# Altium project MOD-COIL-LN2-21.PrjPCB (part 4 of 4)

## Sheet Power_Supply.SchDoc: Power Supply
size A3; Author: M.Beldyga; CompanyName: WUT ISE; DrawnBy: M.Beldyga; Organization: WUT ISE; Address1: PW ISE; Address2: Nowowiejska 15/19 00-665 Warsaw; Address3: micbeldyga@gmail.com; SheetNumber: 9; SheetTotal: 9; ModifiedBy: -; CheckedDate: -; DivGrp: WUT ISE; Designer: M.Beldyga; ModifiedDate: -; ProjectName: Sensor Box
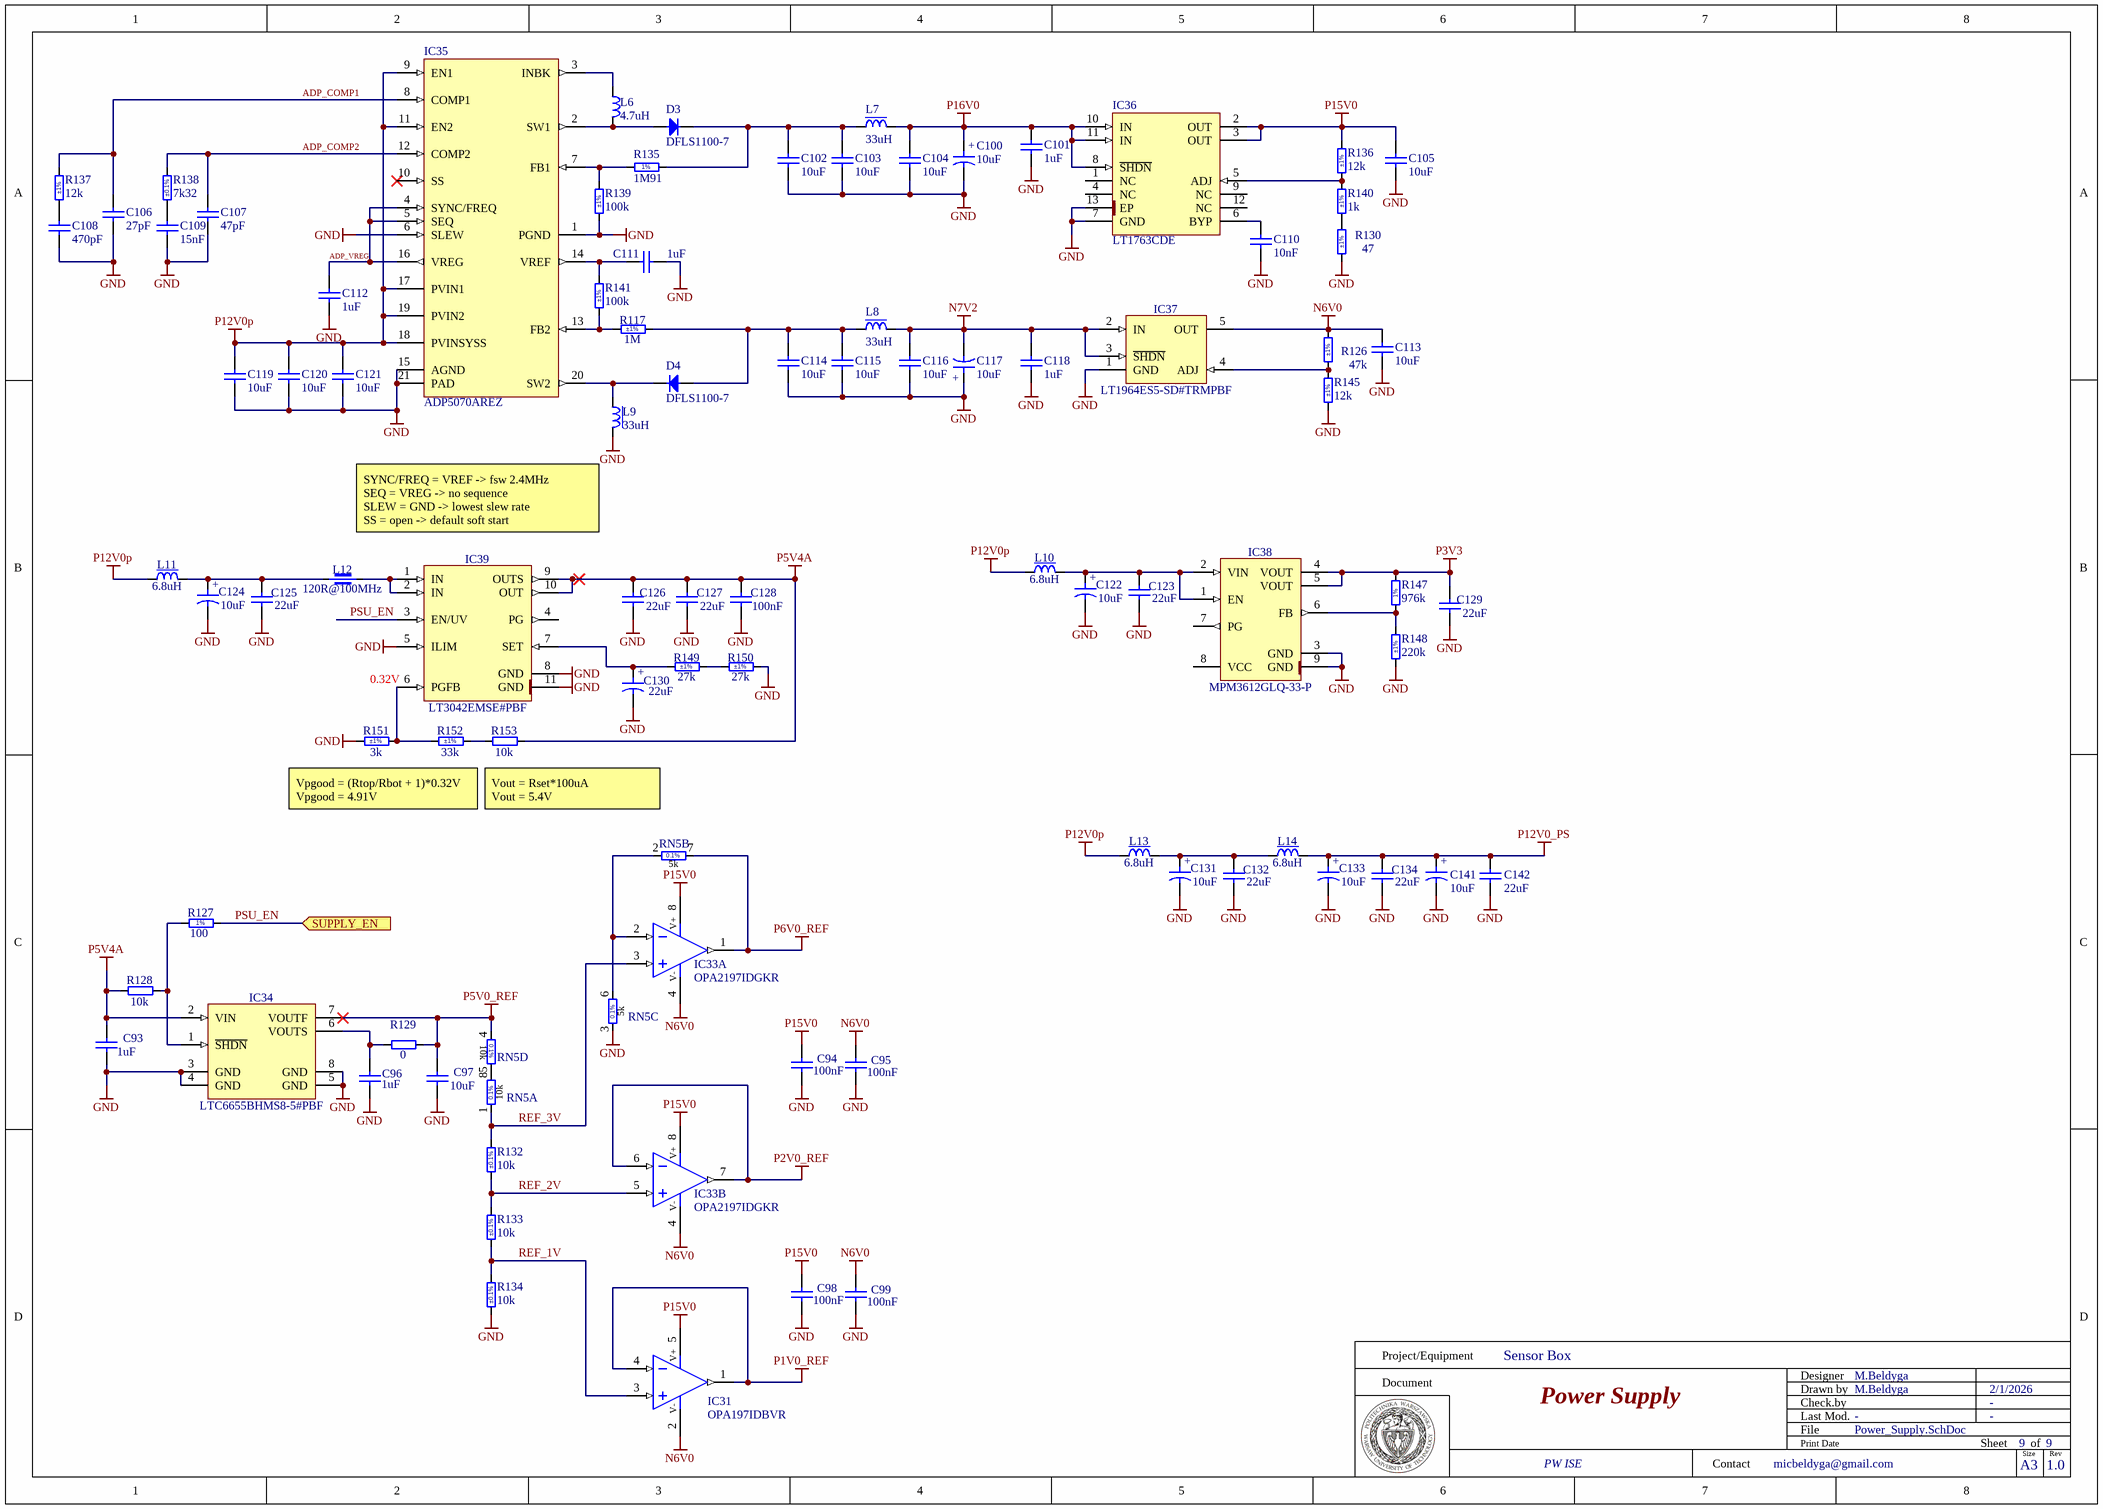
[diagram p8: Power_Supply.SchDoc]

### Parts
C93  1uF  [CAPC1608X87N]
C94  100nF  [CAPC1005X55N]
C95  100nF  [CAPC1005X55N]
C96  1uF  [CAPC1608X87N]
C97  10uF  [CAPC1608X80N]
C98  100nF  [CAPC1005X55N]
C99  100nF  [CAPC1005X55N]
C100  10uF  [CAPMP3216X180N]
C101  1uF  [CAPC1608X87N]
C102  10uF  [CAPC1709X100N]
C103  10uF  [CAPC1709X100N]
C104  10uF  [CAPC1709X100N]
C105  10uF  [CAPC1709X100N]
C106  27pF  [CAPC1005X55N]
C107  47pF  [CAPC1005X55N]
C108  470pF  [CAPC1005X55N]
C109  15nF  [CAPC1005X55N]
C110  10nF  [CAPC1005X55N]
C111  1uF  [CAPC1608X87N]
C112  1uF  [CAPC1608X87N]
C113  10uF  [CAPC1709X100N]
C114  10uF  [CAPC1709X100N]
C115  10uF  [CAPC1709X100N]
C116  10uF  [CAPC1709X100N]
C117  10uF  [CAPMP3216X180N]
C118  1uF  [CAPC1608X87N]
C119  10uF  [CAPC1709X100N]
C120  10uF  [CAPC1709X100N]
C121  10uF  [CAPC1709X100N]
C122  10uF  [CAPMP3216X180N]
C123  22uF  [CAPC2012X135N]
C124  10uF  [CAPMP3216X180N]
C125  22uF  [CAPC2012X135N]
C126  22uF  [CAPC2012X135N]
C127  22uF  [CAPC2012X135N]
C128  100nF  [CAPC1005X55N]
C129  22uF  [CAPC2012X135N]
C130  22uF  [CAPMP3528X210N]
C131  10uF  [CAPMP3216X180N]
C132  22uF  [CAPC2012X135N]
C133  10uF  [CAPMP3216X180N]
C134  22uF  [CAPC2012X135N]
C141  10uF  [CAPMP3216X180N]
C142  22uF  [CAPC2012X135N]
D3  DFLS1100-7  [DIODES-INC_POWERDI123]
D4  DFLS1100-7  [DIODES-INC_POWERDI123]
IC31  OPA197IDBVR  [SOT95P280X145-5N]
IC33  OPA2197IDGKR  [SOP65P490X110-8N]  (parts A,B of 2)
IC34  LTC6655BHMS8-5#PBF  [SOP65P490X110-8N]
IC35  ADP5070AREZ  [SOP65P640X120-21N-R305X425]
IC36  LT1763CDE  [SON50P300X400X80-13N-R180X340]
IC37  LT1964ES5-SD#TRMPBF  [SOT95P280X100-5N]
IC38  MPM3612GLQ-33-P  [MPS_MPM3612]
IC39  LT3042EMSE#PBF  [SOP50P490X110-11N-R168X198]
L6  4.7uH  [IND_COILCRAFT_EPL3015]
L7  33uH  [IND_WURTH_WE-TPC_4828]
L8  33uH  [IND_WURTH_WE-TPC_4828]
L9  33uH  [IND_WURTH_WE-TPC_4828]
L10  6.8uH  [IND_COILCRAFT_XAL4030]
L11  6.8uH  [IND_COILCRAFT_XAL4030]
L12  120R@100MHz  [INDC1608X65N]
L13  6.8uH  [IND_COILCRAFT_XAL4030]
L14  6.8uH  [IND_COILCRAFT_XAL4030]
R117  1M  Tolerance: ±1%  [RESC1005X40N]
R126  47k  Tolerance: ±1%  [RESC1005X40N]
R127  100  [RESC1005X40N]
R128  10k  [RESC1005X35N]
R129  0  [RESC1005X40N]
R130  47  Tolerance: ±1%  [RESC1608X55N]
R132  10k  Tolerance: ±0.1%  [RESC1005X35N]
R133  10k  Tolerance: ±0.1%  [RESC1005X35N]
R134  10k  Tolerance: ±0.1%  [RESC1005X35N]
R135  1M91  [RESC1005X40N]
R136  12k  Tolerance: ±1%  [RESC1005X40N]
R137  12k  Tolerance: ±1%  [RESC1005X40N]
R138  7k32  Tolerance: ±0.1%  [RESC1608X55N]
R139  100k  Tolerance: ±1%  [RESC1005X40N]
R140  1k  Tolerance: ±1%  [RESC1005X40N]
R141  100k  Tolerance: ±1%  [RESC1005X40N]
R145  12k  Tolerance: ±1%  [RESC1005X40N]
R147  976k  [RESC1005X40N]
R148  220k  Tolerance: ±1%  [RESC1005X40N]
R149  27k  Tolerance: ±1%  [RESC1005X40N]
R150  27k  Tolerance: ±1%  [RESC1005X40N]
R151  3k  Tolerance: ±1%  [RESC1005X40N]
R152  33k  Tolerance: ±1%  [RESC1005X40N]
R153  10k  [RESC1005X35N]
RN5  10k 5K 5K 10K  [SOIC127P600X175-8N]  (value not drawn)  (parts A,B,C,D of 4)

### Ports
SUPPLY_EN (in)

### Nets
GND: C93.1 C94.1 C95.1 C96.1 C97.1 C98.1 C99.1 C100.2 C101.1 C102.1 C103.1 C104.1 C105.1 C106.1 C107.1 C108.1 C109.1 C110.1 C111.1 C112.1 C113.1 C114.1 C115.1 C116.1 C117.1 C118.1 C119.1 C120.1 C121.1 C122.2 C123.1 C124.2 C125.1 C126.1 C127.1 C128.1 C129.1 C130.2 C131.2 C132.1 C133.2 C134.1 C141.2 C142.1 IC34.3(GND) IC34.4(GND) IC34.5(GND) IC34.8(GND) IC35.1(PGND) IC35.6(SLEW) IC35.15(AGND) IC35.21(PAD) IC36.7(GND) IC36.13(EP) IC37.1(GND) IC38.3(GND) IC38.9(GND) IC39.5(ILIM) IC39.8(GND) IC39.11(GND) L9.2 R130.1 R134.1 R139.1 R145.1 R148.1 R150.2 R151.1 RN5.3
N6V0: C95.2 C99.2 C113.2 IC31.2(V-) IC33.4(V-) IC37.5(OUT) R126.2
N7V2: C116.2 C117.2 C118.2 IC37.2(IN) IC37.3(~{SHDN}) L8.2
P1V0_REF: IC31.1(OUT) IC31.4(IN-)
P2V0_REF: IC33.6(IN-) IC33.7(OUT)
P3V3: C129.2 IC38.4(VOUT) IC38.5(VOUT) R147.2
P5V0_REF: C97.2 IC34.7(VOUTF) R129.2 RN5.4
P5V4A: C93.2 C126.2 C127.2 C128.2 IC34.2(VIN) IC39.9(OUTS) IC39.10(OUT) R128.1 R153.2
P6V0_REF: IC33.1(OUT) RN5.7
P12V0_PS: C133.1 C134.2 C141.1 C142.2 L14.2
P12V0p: C119.2 C120.2 C121.2 IC35.9(EN1) IC35.11(EN2) IC35.17(PVIN1) IC35.18(PVINSYSS) IC35.19(PVIN2) L10.1 L11.1 L13.1
P15V0: C94.2 C98.2 C105.2 IC31.5(V+) IC33.8(V+) IC36.2(OUT) IC36.3(OUT) R136.2
P16V0: C100.1 C101.2 C104.2 IC36.8(~{SHDN}) IC36.10(IN) IC36.11(IN) L7.2
ADP_COMP1: C106.2 IC35.8(COMP1) R137.2
ADP_COMP2: C107.2 IC35.12(COMP2) R138.2
ADP_VREG: C112.2 IC35.4(SYNC/FREQ) IC35.5(SEQ) IC35.16(VREG)
PSU_EN: IC39.3(EN/UV) R127.2 ; port SUPPLY_EN  [project net Payload_EN]
REF_1V: IC31.3(IN+) R133.1 R134.2
REF_2V: IC33.5(IN+) R132.1 R133.2
REF_3V: IC33.3(IN+) R132.2 RN5.1
NetC96_2: C96.2 IC34.6(VOUTS) R129.1
NetC102_2: C102.2 C103.2 D3.1(C) L7.1 R135.2
NetC108_2: C108.2 R137.1
NetC109_2: C109.2 R138.1
NetC110_2: C110.2 IC36.6(BYP)
NetC111_2: C111.2 IC35.14(VREF) R141.2
NetC114_2: C114.2 C115.2 D4.2(A) L8.1 R117.2
NetC122_1: C122.1 C123.2 IC38.1(EN) IC38.2(VIN) L10.2
NetC124_1: C124.1 C125.2 L11.2 L12.1
NetC130_1: C130.1 IC39.7(SET) R149.1
NetC131_1: C131.1 C132.2 L13.2 L14.1
NetD3_2: D3.2(A) IC35.2(SW1) L6.2
NetD4_1: D4.1(C) IC35.20(SW2) L9.1
NetIC33_2: IC33.2(IN-) RN5.2 RN5.6
NetIC34_1: IC34.1(~{SHDN}) R127.1 R128.2
NetIC35_3: IC35.3(INBK) L6.1
NetIC35_7: IC35.7(FB1) R135.1 R139.2
NetIC35_13: IC35.13(FB2) R117.1 R141.1
NetIC36_5: IC36.5(ADJ) R136.1 R140.2
NetIC37_4: IC37.4(ADJ) R126.1 R145.2
NetIC38_6: IC38.6(FB) R147.1 R148.2
NetIC39_1: IC39.1(IN) IC39.2(IN) L12.2
NetIC39_6: IC39.6(PGFB) R151.2 R152.1
NetR130_2: R130.2 R140.1
NetR149_2: R149.2 R150.1
NetR152_2: R152.2 R153.1
NetRN5_5: RN5.5 RN5.8

Not connected (* = marked no-connect by the designer): IC35 10(SS)*; IC36 1(NC) 4(NC) 9(NC) 12(NC); IC38 7(PG) 8(VCC); IC39 4(PG)

### Notes on the sheet
- SYNC/FREQ = VREF -> fsw 2.4MHz
  SEQ = VREG -> no sequence
  SLEW = GND -> lowest slew rate
  SS = open -> default soft start
- (near IC39) 0.32V
- Vpgood = (Rtop/Rbot + 1)*0.32V
  Vpgood = 4.91V
- Vout = Rset*100uA
  Vout = 5.4V
- Project/Equipment
- Document
- Designer
- Drawn by
- Check.by
- Contact
- File
- Last Mod.
- Print Date
- Sheet
- Size
- A3
- of
- Rev
- (in symbol CTE3216-18_10UF_16V_20%_AVX_TCJ) +
- (in symbol CTE3528-21_22UF_10V_10%_LESR0700) +
- (in symbol R0402_100R_1%_0.0625W_100PPM) 1%
- (in symbol RN_10K_5K_VISHAY_AORN2-1AT3, part A) 10k
- (in symbol RN_10K_5K_VISHAY_AORN2-1AT3, part B) 5k
- (in symbol RN_10K_5K_VISHAY_AORN2-1AT3, part C) 5k
- (in symbol RN_10K_5K_VISHAY_AORN2-1AT3, part D) 10k

### Library data of the parts
C93 C96 = CC0603_1UF_25V_10%_X7R: Non-polarised capacitor; Part Description: SMD Multilayer Chip Ceramic Capacitor; Manufacturer: GENERIC; Manufacturer1 Part Number: GCM188R71E105KA64D; Voltage: 25V; TC: X7R; Tolerance: ±10%; Part Number: CC0603_1UF_25V_10%_X7R; Component Kind: Standard; Component Type: Standard; Pin Count: 2; Value: 1uF; Status: None; Manufacturer Part Number: CC0603_1UF_25V_10%_X7R; Case: 0603; Mounted: Yes; Socket: No; SMD: Yes; Sense: No; Manufacturer1 Example: MURATA; Manufacturer1 ComponentHeight: 0.9mm; HelpURL: \\cern.ch\dfs\Applications\Altium\Datasheets\CC0603_X7R_MURATA.pdf; Author: CERN DEM JLC; CreateDate: 18.01.2011; LatestRevisionDate: 18.01.2011
C94 C95 C98 C99 C128 = CC0402_100NF_16V_10%_X5R: as C51-C53 on sheet Power_Stage; Part Number: CC0402_100NF_16V_10%_X5R; Component Kind: Standard; Component Type: Standard; Pin Count: 2; Value: 100nF; Status: None; Manufacturer Part Number: CC0402_100NF_16V_10%_X5R; Case: 0402; Mounted: Yes; Socket: No; SMD: Yes; Sense: No; Manufacturer1 Example: MURATA; Manufacturer1 ComponentHeight: 0.55mm; HelpURL: \\cern.ch\dfs\Applications\Altium\Datasheets\CC0402_X5R_MURATA_GRM.pdf; Author: CERN DEM JLC; CreateDate: 10.12.2013; LatestRevisionDate: 10.12.2013
C97 = CC0603_10UF_16V_20%_X5R: Non-polarised capacitor; Part Description: SMD Multilayer Chip Ceramic Capacitor; Manufacturer: GENERIC; Manufacturer1 Part Number: GRM188R61C106MA73D; Voltage: 16V; TC: X5R; Tolerance: ±20%; Part Number: CC0603_10UF_16V_20%_X5R; Component Kind: Standard; Component Type: Standard; Pin Count: 2; Value: 10uF; Status: None; Manufacturer Part Number: CC0603_10UF_16V_20%_X5R; Case: 0603; Mounted: Yes; Socket: No; SMD: Yes; Sense: No; Manufacturer1 Example: MURATA; Manufacturer1 ComponentHeight: 0.8mm; HelpURL: \\cern.ch\dfs\Applications\Altium\Datasheets\CC0603_X5R_MURATA_GRM.pdf; Author: CERN DEM MR; CreateDate: 02.03.2016; LatestRevisionDate: 02.03.2016
C100 C117 = CTE3216-18_10UF_16V_20%_AVX_TCJ: Polarised capacitor; Part Description: ESR 0R200 Tantalum Solid Electrolytic Chip Capacitor with Conductive Polymer Electrode; Manufacturer: AVX; Manufacturer Part Number: TCJA106M016R0200; Voltage: 16V; Tolerance: ±20%; Part Number: CTE3216-18_10UF_16V_20%_AVX_TCJ; Component Kind: Standard; Component Type: Standard; Pin Count: 2; Value: 10uF; Status: Preferred; Case: A; Mounted: Yes; Socket: No; SMD: Yes; Sense: No; ComponentHeight: 1.8mm; HelpURL: \\cern.ch\dfs\Applications\Altium\Datasheets\CTE_AVX_TCJ.pdf; Author: CERN DEM JLC; CreateDate: 29.03.2012; LatestRevisionDate: 29.03.2012
C101 C111 C112 C118 = CC0603_1UF_25V_10%_X7R: Non-polarised capacitor; Part Description: SMD Multilayer Chip Ceramic Capacitor; Manufacturer: GENERIC; Manufacturer1 Part Number: GRM188R71E105KA12D; Voltage: 25V; TC: X7R; Tolerance: ±10%; Part Number: CC0603_1UF_25V_10%_X7R; Component Kind: Standard; Component Type: Standard; Pin Count: 2; Value: 1uF; Status: None; Manufacturer Part Number: CC0603_1UF_25V_10%_X7R; Case: 0603; Mounted: Yes; Socket: No; SMD: Yes; Sense: No; Manufacturer1 Example: MURATA; Manufacturer1 ComponentHeight: 0.9mm; HelpURL: \\cern.ch\dfs\Applications\Altium\Datasheets\CC0603_X7R_MURATA.pdf; Author: CERN DEM JLC; CreateDate: 1/18/2011; LatestRevisionDate: 1/18/2011
C102-C105 C113-C116 C119-C121 = CC0603_10UF_25V_20%_X5R: Non-polarised capacitor; Part Description: SMD Multilayer Chip Ceramic Capacitor; Manufacturer: GENERIC; Manufacturer1 Part Number: C1608X5R1E106M080; Voltage: 25V; TC: X5R; Tolerance: ±20%; Part Number: CC0603_10UF_25V_20%_X5R; Component Kind: Standard; Component Type: Standard; Pin Count: 2; Value: 10uF; Status: None; Manufacturer Part Number: CC0603_10UF_25V_20%_X5R; Case: 0603; Mounted: Yes; Socket: No; SMD: Yes; Sense: No; Manufacturer1 Example: TDK; Manufacturer1 ComponentHeight: 1mm; HelpURL: \\cern.ch\dfs\Applications\Altium\Datasheets\CC0603_X5R_TDK_C.pdf; Author: CERN DEM BC; CreateDate: 7/1/2020; LatestRevisionDate: 7/1/2020
C106 = CC0402_27PF_50V_5%_C0G: Non-polarised capacitor; Part Description: SMD Multilayer Chip Ceramic Capacitor; Manufacturer: GENERIC; Manufacturer1 Part Number: C0402C270J5GACTU; Voltage: 50V; TC: C0G/NP0; Tolerance: ±5%; Part Number: CC0402_27PF_50V_5%_C0G; Component Kind: Standard; Component Type: Standard; Pin Count: 2; Value: 27pF; Status: Preferred; Manufacturer Part Number: CC0402_27PF_50V_5%_C0G; Case: 0402; Mounted: Yes; Socket: No; SMD: Yes; Sense: No; Manufacturer1 Example: KEMET; Manufacturer1 ComponentHeight: 0.55mm; HelpURL: \\cern.ch\dfs\Applications\Altium\Datasheets\CC0402_C0G_KEMET_(Commercial Grade).pdf; Author: CERN DEM JLC; CreateDate: 10/25/2012; LatestRevisionDate: 4/22/2015
C107 = CC0402_47PF_50V_5%_C0G: Non-polarised capacitor; Part Description: SMD Multilayer Chip Ceramic Capacitor; Manufacturer: GENERIC; Manufacturer1 Part Number: C0402C470J5GACTU; Voltage: 50V; TC: C0G/NP0; Tolerance: ±5%; Part Number: CC0402_47PF_50V_5%_C0G; Component Kind: Standard; Component Type: Standard; Pin Count: 2; Value: 47pF; Status: Preferred; Manufacturer Part Number: CC0402_47PF_50V_5%_C0G; Case: 0402; Mounted: Yes; Socket: No; SMD: Yes; Sense: No; Manufacturer1 Example: KEMET; Manufacturer1 ComponentHeight: 0.55mm; HelpURL: \\cern.ch\dfs\Applications\Altium\Datasheets\CC0402_C0G_KEMET_(Commercial Grade).pdf; Author: CERN DEM JLC; CreateDate: 12/3/2007; LatestRevisionDate: 4/22/2015
C108 = CC0402_470PF_50V_10%_X7R: Non-polarised capacitor; Part Description: SMD Multilayer Chip Ceramic Capacitor; Manufacturer: GENERIC; Manufacturer1 Part Number: 223858715618; Voltage: 50V; TC: X7R; Tolerance: ±10%; Part Number: CC0402_470PF_50V_10%_X7R; Component Kind: Standard; Component Type: Standard; Pin Count: 2; Value: 470pF; Status: Not Recommended; Manufacturer Part Number: CC0402_470PF_50V_10%_X7R; Case: 0402; Mounted: Yes; Socket: No; SMD: Yes; Sense: No; Manufacturer1 Example: PHYCOMP; Manufacturer1 ComponentHeight: 0.55mm; HelpURL: \\cern.ch\dfs\Applications\Altium\Datasheets\CC0402_NP0_PHYCOMP.pdf; Author: CERN DEM JLC; CreateDate: 12/3/2007; LatestRevisionDate: 12/3/2007
C109 = CC0402_15NF_50V_5%_X7R: Non-polarised capacitor; Part Description: SMD Multilayer Chip Ceramic Capacitor; Manufacturer: GENERIC; Manufacturer1 Part Number: C0402C153J5RACTU; Voltage: 50V; TC: X7R; Tolerance: ±5%; Part Number: CC0402_15NF_50V_5%_X7R; Component Kind: Standard; Component Type: Standard; Pin Count: 2; Value: 15nF; Status: Preferred; Manufacturer Part Number: CC0402_15NF_50V_5%_X7R; Case: 0402; Mounted: Yes; Socket: No; SMD: Yes; Sense: No; Manufacturer1 Example: KEMET; Manufacturer1 ComponentHeight: 0.55mm; HelpURL: \\cern.ch\dfs\Applications\Altium\Datasheets\CC0402_X7R_KEMET.pdf; Author: CERN DEM BC; CreateDate: 9/2/2019; LatestRevisionDate: 9/2/2019
C110 = CC0402_10NF_50V_5%_X7R: Non-polarised capacitor; Part Description: SMD Multilayer Chip Ceramic Capacitor; Manufacturer: GENERIC; Manufacturer1 Part Number: C0402C103J5RAC; Voltage: 50V; TC: X7R; Tolerance: ±5%; Part Number: CC0402_10NF_50V_5%_X7R; Component Kind: Standard; Component Type: Standard; Pin Count: 2; Value: 10nF; Status: Preferred; Manufacturer Part Number: CC0402_10NF_50V_5%_X7R; Case: 0402; Mounted: Yes; Socket: No; SMD: Yes; Sense: No; Manufacturer1 Example: KEMET; Manufacturer1 ComponentHeight: 0.55mm; HelpURL: \\cern.ch\dfs\Applications\Altium\Datasheets\CC0402_X7R_KEMET.pdf; Author: CERN DEM BC; CreateDate: 7/15/2020; LatestRevisionDate: 7/15/2020
C122 C124 C131 C133 C141 = CTE3216-18_10UF_16V_20%_AVX_TCJ: Polarised capacitor; Part Description: ESR 0R200 Tantalum Solid Electrolytic Chip Capacitor with Conductive Polymer Electrode; Manufacturer: AVX; Manufacturer Part Number: TCJA106M016R0200 or  or TR3A106K016C1700; Manufacturer1 Part Number: TCJA106M016R0200; Voltage: 16V; Tolerance: ±20%; Part Number: CTE3216-18_10UF_16V_20%_AVX_TCJ; Component Kind: Standard; Component Type: Standard; Pin Count: 2; Value: 10uF; Status: Preferred; Case: A; Mounted: Yes; Socket: No; SMD: Yes; Sense: No; ComponentHeight: 1.8mm; HelpURL: \\cern.ch\dfs\Applications\Altium\Datasheets\CTE_AVX_TCJ.pdf; Author: CERN DEM JLC; CreateDate: 29.03.2012; LatestRevisionDate: 29.03.2012
C123 C125-C127 C129 C132 C134 C142 = CC0805_22UF_16V_10%_X5R: Non-polarised capacitor; Part Description: SMD Multilayer Chip Ceramic Capacitor; Manufacturer: GENERIC; Manufacturer1 Part Number: C2012X5R1C226KT; Voltage: 16V; TC: X5R; Tolerance: ±10%; Part Number: CC0805_22UF_16V_10%_X5R; Component Kind: Standard; Component Type: Standard; Pin Count: 2; Value: 22uF; Status: Preferred; Manufacturer Part Number: CC0805_22UF_16V_10%_X5R; Case: 0805; Mounted: Yes; Socket: No; SMD: Yes; Sense: No; Manufacturer1 Example: TDK; Manufacturer1 ComponentHeight: 1.35mm; HelpURL: \\cern.ch\dfs\Applications\Altium\Datasheets\CC0805_X5R_TDK_C.pdf; Author: CERN DEM JLC; CreateDate: 25.10.2012; LatestRevisionDate: 25.10.2012
C130 = CTE3528-21_22UF_10V_10%_LESR0700: Polarised capacitor; Part Description: Low ESR 0R7 Solid Tantalum Chip Capacitor; Manufacturer: GENERIC; Manufacturer1 Part Number: TPSB226K010R0700; Voltage: 10V; Tolerance: ±10%; Part Number: CTE3528-21_22UF_10V_10%_LESR0700; Component Kind: Standard; Component Type: Standard; Pin Count: 2; Value: 22uF; Status: Preferred; Manufacturer Part Number: CTE3528-21_22UF_10V_10%_LESR0700; Case: B; Mounted: Yes; Socket: No; SMD: Yes; Sense: No; Manufacturer1 Example: AVX; Manufacturer1 ComponentHeight: 2.1mm; HelpURL: \\cern.ch\dfs\Applications\Altium\Datasheets\CTE-LESR_AVX_TPS.pdf; Author: CERN DEM JLC; CreateDate: 05.05.2008; LatestRevisionDate: 20.01.2009
D3 D4 = DFLS1100-7: Diode; Part Description: High Voltage Schttky Barrier Rectifier; Manufacturer: DIODES INCORPORATED; Voltage: 100V; Power: 1A; PressFit: No; Bonding: No; Part Number: DFLS1100-7; Component Kind: Standard; Component Type: Standard; Device: DFLS1100-7; PackageDescription: SODFL Diode; 2.8mm W X 1.78mm L X mm H Body, POWERDI®123 Case; Manufacturer Part Number: DFLS1100-7; Pin Count: 2; Mounted: Yes; Socket: No; SMD: Yes; Sense: No; ComponentHeight: 1mm; HelpURL: \\cern.ch\dfs\Applications\Altium\Datasheets\DFLS1100-7.pdf; Author: CERN DEM HF; CreateDate: 3/28/2024; LatestRevisionDate: 3/28/2024
IC31 = OPA197IDBVR: Op Amp Single Precision Amplifier R-R I/O ±18V/36V 5-Pin SOT-23 T/R; Manufacturer: Texas Instruments; Manufacturer Lifecycle Status: ACTIVE; Gain Bandwidth Product: 10MHz; Input Bias Current: 5pA; Input Offset Voltage (Vos): 25µV; Number of Channels: 1; Operating Supply Current: 1mA; Output Current per Channel: 65mA; Slew Rate: 20V/µs; Supplier: DigiKey; Supplier Part Number: 296-47813-6-ND; Manufacturer Part Number: OPA197IDBVR; RoHS: Compliant; Category: Amplifiers - Op Amps, Buffer, Instrumentation; Pricing: 1=1.71, 10=1.254, 25=1.1404, 100=1.0149, 250=0.95512, 500=0.9191, 1000=0.88942 (USD); Case/Package: SOT-23; Height: 1.45mm; Lead Free: Lead Free; Length: 2.9mm; Lifecycle Status: Production; Max Operating Temperature: 125°C; Min Operating Temperature: -40°C; Mounting Technology: Surface Mount; Number of Circuits: 1; Pins: 5; Schedule B: 8542330000, 8542330000|8542330000|8542330000|8542330000|8542330000|8542330000|8542330000|8542330000|8542330000|8542330000|8542330000|8542330000|8542330000|8542330000|8542330000|8542330000|8542330000|8542330000|8542330000|8542330000|8542330000|8542330000|8542330000|85; Thickness: 1.2mm; Width: 1.6mm; ComponentLink1URL: https://sigma.octopart.com:443/177332311/technical_drawing/Texas-Instruments-OPA197IDBVR.pdf?src-supplier=Texas+Instruments; ComponentLink1Description: https://sigma.octopart.com:443/177332311/technical_drawing/Texas-Instruments-OPA197IDBVR.pdf?src-supplier=Texas+Instruments; ComponentLink2URL: https://octopart.com:443/opatz8j6/c1?t=Q1P8Bdc4KgCCbFqp7UlYpcJ8AhpVpiPIEDSj71pxBcZVcsUhmuEmpKuLfuswML2SqYTIjZ0KbZTePt0BTa5L0Ib-QO4qx2Pc4AGXPK19iWgmTvAzROBybWvsv8SVdmbKXcfVjzYF5gNG51bfmeDdyG8TPrSMEhnU0XxyolWqRvFZRm1lt3I32W7t_wfMxmeR34edfRjLHyyRFXxPyflRs4eg4WP07F8bmt6pOKmN-USMuy6Faze7x22RpNONDH4EojWIvEjwq6_wS8mD7vZGVP7z7Ngk7vArTcyRg02zIl199DZ1b6QvO1RGY5iVnJ8IHDniUbpBX1tObbv_cSSRQlS6KVLtLLjRXr4EmXhu9GKtw9wXk68tfrl34suuqK6ened5hg&src-supplier=Texas+Instruments; ComponentLink2Description: https://octopart.com:443/opatz8j6/c1?t=Q1P8Bdc4KgCCbFqp7UlYpcJ8AhpVpiPIEDSj71pxBcZVcsUhmuEmpKuLfuswML2SqYTIjZ0KbZTePt0BTa5L0Ib-QO4qx2Pc4AGXPK19iWgmTvAzROBybWvsv8SVdmbKXcfVjzYF5gNG51bfmeDdyG8TPrSMEhnU0XxyolWqRvFZRm1lt3I32W7t_wfMxmeR34edfRjLHyyRFXxPyflRs4eg4WP07F8bmt6pOKmN-USMuy6Faze7x22RpNONDH4EojWIvEjwq6_wS8mD7vZGVP7z7Ngk7vArTcyRg02zIl199DZ1b6QvO1RGY5iVnJ8IHDniUbpBX1tObbv_cSSRQlS6KVLtLLjRXr4EmXhu9GKtw9wXk68tfrl34suuqK6ened5hg&src-supplier=Texas+Instruments; ComponentLink3URL: https://sigma.octopart.com:443/175570406/technical_drawing/Texas-Instruments-OPA197IDBVR.pdf?src-supplier=Texas+Instruments; ComponentLink3Description: https://sigma.octopart.com:443/175570406/technical_drawing/Texas-Instruments-OPA197IDBVR.pdf?src-supplier=Texas+Instruments; ComponentLink4URL: https://sigma.octopart.com:443/169406034/technical_drawing/Texas-Instruments-OPA197IDBVR.pdf?src-supplier=Texas+Instruments; ComponentLink4Description: https://sigma.octopart.com:443/169406034/technical_drawing/Texas-Instruments-OPA197IDBVR.pdf?src-supplier=Texas+Instruments; ComponentLink5URL: https://sigma.octopart.com:443/155939316/technical_drawing/Texas-Instruments-OPA197IDBVR.pdf?src-supplier=Texas+Instruments; ComponentLink5Description: https://sigma.octopart.com:443/155939316/technical_drawing/Texas-Instruments-OPA197IDBVR.pdf?src-supplier=Texas+Instruments; ComponentLink6URL: https://sigma.octopart.com:443/102331370/technical_drawing/Texas-Instruments-OPA197IDBVR.pdf?src-supplier=Texas+Instruments; ComponentLink6Description: https://sigma.octopart.com:443/102331370/technical_drawing/Texas-Instruments-OPA197IDBVR.pdf?src-supplier=Texas+Instruments; ComponentLink7URL: https://datasheet.octopart.com:443/OPA197IDBVR-Texas-Instruments-datasheet-62062805.pdf?src-supplier=Texas+Instruments; ComponentLink7Description: https://datasheet.octopart.com:443/OPA197IDBVR-Texas-Instruments-datasheet-62062805.pdf?src-supplier=Texas+Instruments; ComponentLink8URL: https://sigma.octopart.com:443/49249325/technical_drawing/Texas-Instruments-OPA197IDBVR.pdf?src-supplier=Texas+Instruments; ComponentLink8Description: https://sigma.octopart.com:443/49249325/technical_drawing/Texas-Instruments-OPA197IDBVR.pdf?src-supplier=Texas+Instruments; ComponentLink9URL: https://datasheet.octopart.com:443/OPA197IDBVR-Texas-Instruments-datasheet-164361763.pdf?src-supplier=SHENGYU+ELECTRONICS; ComponentLink9Description: https://datasheet.octopart.com:443/OPA197IDBVR-Texas-Instruments-datasheet-164361763.pdf?src-supplier=SHENGYU+ELECTRONICS; ComponentLink10URL: https://datasheet.octopart.com:443/OPA197IDBVR-Texas-Instruments-datasheet-165804228.pdf?src-supplier=LCSC; ComponentLink10Description: https://datasheet.octopart.com:443/OPA197IDBVR-Texas-Instruments-datasheet-165804228.pdf?src-supplier=LCSC; ComponentLink11URL: https://datasheet.octopart.com:443/OPA197IDBVR-Texas-Instruments-datasheet-159115560.pdf?src-supplier=LCSC; ComponentLink11Description: https://datasheet.octopart.com:443/OPA197IDBVR-Texas-Instruments-datasheet-159115560.pdf?src-supplier=LCSC; ComponentLink12URL: https://datasheet.octopart.com:443/OPA197IDBVR-Texas-Instruments-datasheet-140571582.pdf?src-supplier=Arrow.cn; ComponentLink12Description: https://datasheet.octopart.com:443/OPA197IDBVR-Texas-Instruments-datasheet-140571582.pdf?src-supplier=Arrow.cn; ComponentLink13URL: https://datasheet.octopart.com:443/OPA197IDBVR-Texas-Instruments-datasheet-137316104.pdf?src-supplier=Future+Electronics; ComponentLink13Description: https://datasheet.octopart.com:443/OPA197IDBVR-Texas-Instruments-datasheet-137316104.pdf?src-supplier=Future+Electronics; ComponentLink14URL: http://sigma.octopart.com:80/reach_statement/Texas-Instruments-company-64.pdf?src-supplier=Compliance+Statements; ComponentLink14Description: http://sigma.octopart.com:80/reach_statement/Texas-Instruments-company-64.pdf?src-supplier=Compliance+Statements; ComponentLink15URL: http://sigma.octopart.com:80/conflict_mineral_statement/Texas-Instruments-company-63.pdf?src-supplier=Compliance+Statements; ComponentLink15Description: http://sigma.octopart.com:80/conflict_mineral_statement/Texas-Instruments-company-63.pdf?src-supplier=Compliance+Statements
IC33 = OA_OPA2197IDGKR: 36-V, Precision, Rail-to-Rail Input Output, Low Offset Voltage Op Amp 8-VSSOP; Part Description: High-Precision, Low-Noise, Rail-to-Rail Output,10-MHz Op Amp; Manufacturer1: TEXAS INSTRUMENTS; PressFit: No; Bonding: No; Part Number: OPA2197IDGKR; Component Kind: Standard; Component Type: Standard; Device: OPA2197IDGKR; PackageDescription: SOP, 0.65mm pitch; 8 pin, 3.00mm W X 3.00mm L X 1.10mm H body, IPC Medium Density; Manufacturer1 Part Number: OPA2197IDGKR; Pin Count: 8; Case: MSOP8; Mounted: Yes; Socket: No; SMD: Yes; Sense: No; ComponentHeight: 1.1mm; Author: GK; HelpURL: \\cern.ch\dfs\Applications\Altium\Datasheets\OPA2140AIDGK.pdf; CreateDate: 20.04.2017; LatestRevisionDate: 20.04.2017
IC34 = LTC6655BHMS8-5#PBF: 0.25ppm Noise, Low Drift Precision Buffered Voltage Reference; Part Description: 5V, 0.25ppm Noise, Low Drift Precision Buffered Voltage Reference; Manufacturer1: LINEAR TECHNOLOGY; PressFit: No; Bonding: No; Part Number: LTC6655BHMS8-5#PBF; Component Kind: Standard; Component Type: Standard; Device: LTC6655BHMS8-5#PBF; PackageDescription: SOP, 8-Leads, Body 3.1x3.1mm (max), Pitch 0.65mm, IPC Medium Density; Manufacturer1 Part Number: LTC6655BHMS8-5#PBF; Pin Count: 8; Case: SSOP8; Mounted: Yes; Socket: No; SMD: Yes; Sense: No; ComponentHeight: 1.1mm; HelpURL: \\cern.ch\dfs\Applications\Altium\Datasheets\LTC6655BHMS8-5#PBF.pdf; Author: CERN DEM JLC; CreateDate: 07.06.2012; LatestRevisionDate: 07.06.2012
IC35 = ADP5070AREZ: 1A/0.6A, DC-to-DC Switching Regulator with Independent Positive and Negative Outputs; Manufacturer: ANALOG DEVICES; PressFit: No; Bonding: No; Part Number: ADP5070AREZ; Component Kind: Standard; Component Type: Standard; Device: ADP5070AREZ; PackageDescription: SOP, 0.65mm Pitch; 20 Pin, 4.40mm W X 6.50mm L X 1.20mm H Body (w/Thermal Tab 3.05mm X 4.25mm), IPC Medium Density; Part Description: 1A/0.6A, DC-to-DC Switching Regulator with Independent Positive and Negative Outputs; Manufacturer Part Number: ADP5070ARE; Pin Count: 20; Case: SSOP20; Mounted: Yes; Socket: No; SMD: Yes; Sense: No; ComponentHeight: 1.2mm; HelpURL: \\cern.ch\dfs\Applications\Altium\Datasheets\ADP5070AREZ.pdf; Author: CERN DEM JLC; CreateDate: 6/21/2017; LatestRevisionDate: 4/1/2022
IC36 = LT1763CDE: 1.22V to 20V 500mA, Low Noise, LDO Adjustable Micropower Regulator; Part Description: 1.22V to 20V, 500mA, Low Noise, LDO Adjustable Micropower Regulator; Manufacturer: LINEAR TECHNOLOGY; PressFit: No; Bonding: No; Part Number: LT1763CDE; Component Kind: Standard; Component Type: Standard; Device: LT1763CDE; PackageDescription: SON, (DFN) 0.50mm Pitch; 12 Pin, 3.00mm W X 4.00mm L X 0.80mm H body (w/Thermal Tab 1.80 X 3.40mm), IPC Medium Density; Manufacturer Part Number: LT1763CDE; Pin Count: 13; Case: SON12; Mounted: Yes; Socket: No; SMD: Yes; Sense: No; ComponentHeight: 0.8mm; HelpURL: \\cern.ch\dfs\Applications\Altium\Datasheets\LT1763.pdf; Author: CERN DEM HF; CreateDate: 4/25/2023; LatestRevisionDate: 4/25/2023
IC37 = LT1964ES5-SD#TRMPBF: 200mA, Low Noise, Low Dropout Negative Micropower Regulator; Part Description: -1.22V to -20V, 200mA, Low Noise, Low Dropout Negative Micropower Regulator; Manufacturer: LINEAR TECHNOLOGY; PressFit: No; Bonding: No; Part Number: LT1964ES5-SD#TRMPBF; Component Kind: Standard; Component Type: Standard; Device: LT1964ES5-SD#TRMPBF; PackageDescription: SOT23, 0.95mm pitch; 5 pin, 1.75mm W X 3.00mm L, IPC Medium Density; Manufacturer Part Number: LT1964ES5-SD#TRMPBF; Pin Count: 5; Case: SOT23-5; Mounted: Yes; Socket: No; SMD: Yes; Sense: No; ComponentHeight: 1mm; HelpURL: \\cern.ch\dfs\Applications\Altium\Datasheets\LT1964ES5-SD#TRMPBF.pdf; Author: CERN DEM JLC; CreateDate: 05.05.2009; LatestRevisionDate: 05.05.2009
IC38 = MPM3612GLQ-33-P: 3V to 22V Input, 1A, Ultra-Low 5µA IQ Power Module; Manufacturer: MPS (MONOLITIC  POWER SYSTEMS); PressFit: No; Bonding: No; Part Number: MPM3612GLQ-33-P; Component Kind: Standard; Component Type: Standard; Device: MPM3612GLQ-33-P; PackageDescription: MPS LGA-9 Case, 0.65mm Pitch, Rect.; 8 Pin, 3.00mm L X 3.00mm W X 2.10mm H body (w/Thermal Tab 1.10 X 1.90mm); Part Description: 3V to 22V Input, 1A, Ultra-Low 5µA IQ Power Module; Manufacturer Part Number: MPM3612GLQ-33-P; Pin Count: 9; Case: LGA8; Mounted: Yes; Socket: No; SMD: Yes; Sense: No; ComponentHeight: 2.1mm; HelpURL: \\cern.ch\dfs\Applications\Altium\Datasheets\MPM3612.pdf; Author: CERN DEM HF; CreateDate: 07.01.2026; LatestRevisionDate: 07.01.2026
IC39 = LT3042EMSE#PBF: 20V, 200mA, Ultralow Noise, Ultrahigh PSRR RF Linear Regulator; Manufacturer1: LINEAR TECHNOLOGY; PressFit: No; Bonding: No; Part Number: LT3042EMSE#PBF; Component Kind: Standard; Component Type: Standard; Device: LT3042EMSE#PBF; PackageDescription: SOP, 0.50mm, Pitch; 10 pin, 3.00mm W X 3.00mm L X 1.10mm H body (w/thermal tab  1.68 X 1.98 mm), IPC Medium Density; Part Description: 20V, 200mA, Ultralow Noise, Ultrahigh PSRR RF Linear Regulator; Manufacturer1 Part Number: LT3042EMSE#PBF; Pin Count: 11; Case: MSOP10; Mounted: Yes; Socket: No; SMD: Yes; Sense: No; ComponentHeight: 1.1mm; HelpURL: \\cern.ch\dfs\Applications\Altium\Datasheets\LT3042EMSE#PBF.pdf; Author: CERN DEM MR; CreateDate: 09.06.2016; LatestRevisionDate: 09.06.2016
L6 = IND_4.7UH_20%_COILCRAFT_EPL3015: Inductor; Part Description: Shielded SMD Power Inductor; Manufacturer Part Number: EPL3015-472ML; Power: 1A; Resistance: 0.145R; Tolerance: ±20%; Part Number: IND_4.7UH_20%_COILCRAFT_EPL3015; Component Kind: Standard; Component Type: Standard; Pin Count: 2; Value: 4.7uH; Manufacturer: COILCRAFT; Mounted: Yes; Socket: No; SMD: Yes; Sense: No; ComponentHeight: 1.55mm; HelpURL: \\cern.ch\dfs\Applications\Altium\Datasheets\IND_COILCRAFT_EPL3015.pdf; Author: CERN DEM BC; CreateDate: 2/27/2017; LatestRevisionDate: 2/27/2017
L7-L9 = IND_33UH_30%_WURTH_WE-TPC_744043330: Inductor With Core; Part Description: Shielded Tiny Power Inductor (WE-TPC Series); Manufacturer: WURTH ELEKTRONIK; Power: 820mA; Resistance: 0.23R; Tolerance: ±30%; Part Number: IND_33UH_30%_WURTH_WE-TPC_744043330; Component Kind: Standard; Component Type: Standard; Pin Count: 2; Value: 33uH; Manufacturer Part Number: 744043330; Mounted: Yes; Socket: No; SMD: Yes; Sense: No; ComponentHeight: 3mm; HelpURL: \\cern.ch\dfs\Applications\Altium\Datasheets\IND_WURTH_WE-TPC_744043330.pdf; Author: CERN DEM JLC; CreateDate: 11/24/2014; LatestRevisionDate: 11/24/2014
L10 L11 L13 L14 = IND_6.8UH_20%_COILCRAFT_XAL4030: Inductor With Core; Part Description: SMD Shielded Power Inductor; Manufacturer1 Part Number: XAL4030-682MEC; Power: 3A; Resistance: 0.0741R; Tolerance: ±20%; Part Number: IND_6.8UH_20%_COILCRAFT_XAL4030; Component Kind: Standard; Component Type: Standard; Pin Count: 2; Value: 6.8uH; Status: None; Manufacturer1: COILCRAFT; Mounted: Yes; Socket: No; SMD: Yes; Sense: No; ComponentHeight: 2.1mm; HelpURL: \\cern.ch\dfs\Applications\Altium\Datasheets\IND_COILCRAFT_XAL4030.pdf; Author: CERN DEM MR; CreateDate: 14.03.2016; LatestRevisionDate: 14.03.2016
L12 = IND0603_MURATA_BLM18SG121TN1D: Part Description: SMD EMIFIL Suppression Chip Ferrite Bead; Manufacturer1: MURATA; Power: 3A; Resistance: 0.025R; Tolerance: ±25%; Part Number: IND0603_MURATA_BLM18SG121TN1D; Component Kind: Standard; Component Type: Standard; Pin Count: 2; Value: 120R@100MHz; Manufacturer1 Part Number: BLM18SG121TN1D; Case: 0603; Mounted: Yes; Socket: No; SMD: Yes; Sense: No; ComponentHeight: 0.65mm; HelpURL: \\cern.ch\dfs\Applications\Altium\Datasheets\IND0603_MURATA_BLM18S.pdf; Author: CERN DEM JLC; CreateDate: 23.07.2014; LatestRevisionDate: 25.10.2018
R117 = R0402_1M_1%_0.0625W_100PPM: Resistor - 1%; Part Description: General Purpose Thick Film Chip Resistor; Manufacturer: GENERIC; Manufacturer1 Part Number: 232270671005L; TC: ±100ppm/°C; PressFit: No; Part Number: R0402_1M_1%_0.0625W_100PPM; Component Kind: Standard; Component Type: Standard; Pin Count: 2; Value: 1M; Status: Not Recommended; Power: 0.0625W; Manufacturer Part Number: R0402_1M_1%_0.0625W_100PPM; Case: 0402; Mounted: Yes; Sense: No; Socket: No; SMD: Yes; Manufacturer1 ComponentHeight: 0.4mm; HelpURL: \\cern.ch\dfs\Applications\Altium\Datasheets\R0402_Phycomp_RC0402.pdf; Author: CERN DEM JLC; CreateDate: 12/3/2007; LatestRevisionDate: 10/17/2012; Manufacturer1 Example: YAGEO PHYCOMP
R126 = R0402_47K_1%_0.0625W_100PPM: Resistor - 1%; Part Description: General Purpose Thick Film Chip Resistor; Manufacturer: GENERIC; Manufacturer1 Part Number: 232270674703L; TC: ±100ppm/°C; PressFit: No; Part Number: R0402_47K_1%_0.0625W_100PPM; Component Kind: Standard; Component Type: Standard; Pin Count: 2; Value: 47k; Status: Not Recommended; Power: 0.0625W; Manufacturer Part Number: R0402_47K_1%_0.0625W_100PPM; Case: 0402; Mounted: Yes; Sense: No; Socket: No; SMD: Yes; Manufacturer1 Example: YAGEO PHYCOMP; Manufacturer1 ComponentHeight: 0.4mm; HelpURL: \\cern.ch\dfs\Applications\Altium\Datasheets\R0402_Phycomp_RC0402.pdf; Author: CERN DEM JLC; CreateDate: 03.12.2007; LatestRevisionDate: 17.10.2012
R127 = R0402_100R_1%_0.0625W_100PPM: Resistor - 1%; Part Description: General Purpose Thick Film Chip Resistor; Manufacturer: GENERIC; Manufacturer1: Vishay; Manufacturer1 Part Number: RCA0402100RFKED; TC: ±100ppm/°C; PressFit: No; Part Number: R0402_100R_1%_0.0625W_100PPM; Component Kind: Standard; Component Type: Standard; Pin Count: 2; Value: 100; Status: Not Recommended; Power: 0.0625W; Tolerance: ±1%; Manufacturer Part Number: R0402_100R_1%_0.0625W_100PPM; Case: 0402; Mounted: Yes; Sense: No; Socket: No; SMD: Yes; Manufacturer1 ComponentHeight: 0.4mm; HelpURL: \\cern.ch\dfs\Applications\Altium\Datasheets\R0402_Phycomp_RC0402.pdf; Author: CERN DEM JLC; CreateDate: 03.12.2007; LatestRevisionDate: 17.10.2012
R128 R132-R134 R153 = R0402_10K_0.1%_0.063W_25PPM: Resistor - 0.1%; Part Description: Thin Film Precision Resistor; Manufacturer: GENERIC; Manufacturer1 Part Number: CPF0402B10KE1; Power: 0.063W; TC: ±25ppm/°C; PressFit: No; Part Number: R0402_10K_0.1%_0.063W_25PPM; Component Kind: Standard; Component Type: Standard; Pin Count: 2; Value: 10k; Status: Not Recommended; Manufacturer Part Number: R0402_10K_0.1%_0.063W_25PPM; Case: 0402; Mounted: Yes; Sense: No; Socket: No; SMD: Yes; Manufacturer1 ComponentHeight: 0.35mm; HelpURL: \\cern.ch\dfs\Applications\Altium\Datasheets\R0402_TYCO_CPF.pdf; Author: CERN DEM JMW; CreateDate: 9/22/2015; LatestRevisionDate: 9/22/2015; Manufacturer1 Example: TE CONNECTIVITY
  R128 R153: Tolerance: ±0.1%
R129 = R0402_0R_JUMPER: Resistor; Part Description: 1A (0.05R Max DC Resistance) Zero Ohm Jumper; Manufacturer: GENERIC; Manufacturer1: Vishay; Manufacturer1 Part Number: CRCW04020000Z0EDC; Part Number: R0402_0R_JUMPER; Component Kind: Standard; Component Type: Standard; Pin Count: 2; Value: 0; Status: Not recommended; Manufacturer Part Number: R0402_0R_JUMPER; Case: 0402; Mounted: Yes; Sense: No; Socket: No; SMD: Yes; Manufacturer1 ComponentHeight: 0.4mm; HelpURL: \\cern.ch\dfs\Applications\Altium\Datasheets\R0402_Phycomp_RC0402.pdf; Author: CERN DEM JLC; CreateDate: 03.12.2007; LatestRevisionDate: 17.10.2012
R130 = R0603_47R_1%_0.1W_100PPM: Resistor - 1%; Part Description: General Purpose Thick Film Chip Resistor; Manufacturer: GENERIC; Manufacturer1 Part Number: NRC06F47R0TRF; Power: 0.1W; TC: ±100ppm/°C; PressFit: No; Part Number: R0603_47R_1%_0.1W_100PPM; Component Kind: Standard; Component Type: Standard; Pin Count: 2; Value: 47; Status: Preferred; Manufacturer Part Number: R0603_47R_1%_0.1W_100PPM; Case: 0603; Mounted: Yes; Sense: No; Socket: No; SMD: Yes; Manufacturer1 Example: NIC COMPONENT; Manufacturer1 ComponentHeight: 0.55mm; HelpURL: \\cern.ch\dfs\Applications\Altium\Datasheets\R0603_NIC_NRC.pdf; Author: CERN DEM JLC; CreateDate: 03.12.2007; LatestRevisionDate: 13.03.2008
R135 = R0402_1M91_1%_0.0625W: RES 1M91 OHM 1% 1/16W 0402; Manufacturer: GENERIC; Manufacturer 1: Yageo; Manufacturer 1 Part Number: RC0402FR-071M91L; Manufacturer 2 Part Number: RMCF0402FT1M91; Manufacturer 3 Part Number: CRCW04021M91FKED; Part Number: R0402_1M91_1%_0.0625W; Component Kind: Standard; Component Type: Standard; Pin Count: 2; Value: 1M91; Power: 0.0625W; Tolerance: 1%; Manufacturer Part Number: R0402_1M91_1%_0.0625W; Case: 0402; Status: Active; Manufacturer 2: Stackpole Electronics; Manufacturer 3: Vishay Dale; Author: Michal Beldyga; CreateDate: 9/16/2024; LastRevision: 9/16/2024
R136 R137 R145 = R0402_12K_1%_0.0625W_100PPM: Resistor - 1%; Part Description: General Purpose Thick Film Chip Resistor; Manufacturer: GENERIC; Manufacturer1 Part Number: 232270671203L; TC: ±100ppm/°C; PressFit: No; Part Number: R0402_12K_1%_0.0625W_100PPM; Component Kind: Standard; Component Type: Standard; Pin Count: 2; Value: 12k; Status: Not Recommended; Power: 0.0625W; Manufacturer Part Number: R0402_12K_1%_0.0625W_100PPM; Case: 0402; Mounted: Yes; Sense: No; Socket: No; SMD: Yes; Manufacturer1 Example: YAGEO PHYCOMP; Manufacturer1 ComponentHeight: 0.4mm; HelpURL: \\cern.ch\dfs\Applications\Altium\Datasheets\R0402_Phycomp_RC0402.pdf; Author: CERN DEM JLC; CreateDate: 12/3/2007; LatestRevisionDate: 10/17/2012
R138 = R0603_7K32_0.1%_0.063W_10PPM: Resistor - 0.1%; Part Description: Thin Film Chip Resistor; Manufacturer: GENERIC; Manufacturer1 Part Number: RN73C1J7K32BTDF; Power: 0.063W; TC: ±10ppm; PressFit: No; Part Number: R0603_7K32_0.1%_0.063W_10PPM; Component Kind: Standard; Component Type: Standard; Pin Count: 2; Value: 7k32; Status: Not Recommended; Manufacturer Part Number: R0603_7K32_0.1%_0.063W_10PPM; Case: 0603; Mounted: Yes; Sense: No; Socket: No; SMD: Yes; Manufacturer1 Example: TYCO HOLSWORTHY; Manufacturer1 ComponentHeight: 0.5mm; HelpURL: \\cern.ch\dfs\Applications\Altium\Datasheets\R0603_Tyco_RN73.pdf; Author: CERN DEM JLC; CreateDate: 12/3/2007; LatestRevisionDate: 3/13/2008
R139 R141 = R0402_100K_1%_0.0625W_100PPM: Resistor - 1%; Part Description: General Purpose Thick Film Chip Resistor; Manufacturer: GENERIC; Manufacturer1 Part Number: 232270671004L; TC: ±100ppm/°C; PressFit: No; Part Number: R0402_100K_1%_0.0625W_100PPM; Component Kind: Standard; Component Type: Standard; Pin Count: 2; Value: 100k; Status: Not Recommended; Power: 0.0625W; Manufacturer Part Number: R0402_100K_1%_0.0625W_100PPM; Case: 0402; Mounted: Yes; Sense: No; Socket: No; SMD: Yes; Manufacturer1 Example: YAGEO PHYCOMP; Manufacturer1 ComponentHeight: 0.4mm; HelpURL: \\cern.ch\dfs\Applications\Altium\Datasheets\R0402_Phycomp_RC0402.pdf; Author: CERN DEM JLC; CreateDate: 12/3/2007; LatestRevisionDate: 10/17/2012
R140 = R0402_1K_1%_0.0625W_100PPM: Resistor - 1%; Part Description: General Purpose Thick Film Chip Resistor; Manufacturer: GENERIC; Manufacturer1 Part Number: 232270671002L; TC: ±100ppm/°C; PressFit: No; Part Number: R0402_1K_1%_0.0625W_100PPM; Component Kind: Standard; Component Type: Standard; Pin Count: 2; Value: 1k; Status: Not Recommended; Power: 0.0625W; Manufacturer Part Number: R0402_1K_1%_0.0625W_100PPM; Case: 0402; Mounted: Yes; Sense: No; Socket: No; SMD: Yes; Manufacturer1 Example: YAGEO PHYCOMP; Manufacturer1 ComponentHeight: 0.4mm; HelpURL: \\cern.ch\dfs\Applications\Altium\Datasheets\R0402_Phycomp_RC0402.pdf; Author: CERN DEM JLC; CreateDate: 12/3/2007; LatestRevisionDate: 10/17/2012
R147 = R0402_976K_1%_0.0625W: RES 976k OHM 1% 1/16W 0402; Manufacturer: GENERIC; Manufacturer 1: Yageo; Manufacturer 1 Part Number: RC0402FR-07976KL; Manufacturer 2 Part Number: RMCF0402FT976K; Manufacturer 3 Part Number: CRCW0402976KFKED; Part Number: R0402_976K_1%_0.0625W; Component Kind: Standard; Component Type: Standard; Pin Count: 2; Value: 976k; Power: 0.0625W; Tolerance: 1%; Manufacturer Part Number: R0402_976K_1%_0.0625W; Case: 0402; Status: Active; Manufacturer 2: Stackpole Electronics; Manufacturer 3: Vishay Dale; Author: Michal Beldyga; CreateDate: 9/16/2024; LastRevision: 9/16/2024
R148 = R0402_220K_1%_0.0625W_100PPM: Resistor - 1%; Part Description: General Purpose Thick Film Chip Resistor; Manufacturer: GENERIC; Manufacturer1 Part Number: 232270672204L; TC: ±100ppm/°C; PressFit: No; Part Number: R0402_220K_1%_0.0625W_100PPM; Component Kind: Standard; Component Type: Standard; Pin Count: 2; Value: 220k; Status: Not Recommended; Power: 0.0625W; Manufacturer Part Number: R0402_220K_1%_0.0625W_100PPM; Case: 0402; Mounted: Yes; Sense: No; Socket: No; SMD: Yes; Manufacturer1 Example: YAGEO PHYCOMP; Manufacturer1 ComponentHeight: 0.4mm; HelpURL: \\cern.ch\dfs\Applications\Altium\Datasheets\R0402_Phycomp_RC0402.pdf; Author: CERN DEM JLC; CreateDate: 12/3/2007; LatestRevisionDate: 10/17/2012
R149 R150 = R0402_27K_1%_0.0625W_100PPM: Resistor - 1%; Part Description: General Purpose Thick Film Chip Resistor; Manufacturer: GENERIC; Manufacturer1 Part Number: 232270672703L; TC: ±100ppm/°C; PressFit: No; Part Number: R0402_27K_1%_0.0625W_100PPM; Component Kind: Standard; Component Type: Standard; Pin Count: 2; Value: 27k; Status: Not Recommended; Power: 0.0625W; Manufacturer Part Number: R0402_27K_1%_0.0625W_100PPM; Case: 0402; Mounted: Yes; Sense: No; Socket: No; SMD: Yes; Manufacturer1 ComponentHeight: 0.4mm; HelpURL: \\cern.ch\dfs\Applications\Altium\Datasheets\R0402_Phycomp_RC0402.pdf; Author: CERN DEM JLC; CreateDate: 12/3/2007; LatestRevisionDate: 10/17/2012; Manufacturer1 Example: YAGEO PHYCOMP
R151 = R0402_3K_1%_0.0625W_100PPM: Resistor - 1%; Part Description: General Purpose Thick Film Chip Resistor; Manufacturer: GENERIC; Manufacturer1: Vishay; Manufacturer1 Part Number: RCS04023K00FKED; TC: ±100ppm/°C; PressFit: No; Part Number: R0402_3K_1%_0.0625W_100PPM; Component Kind: Standard; Component Type: Standard; Pin Count: 2; Value: 3k; Status: Not Recommended; Power: 0.0625W; Manufacturer Part Number: R0402_3K_1%_0.0625W_100PPM; Case: 0402; Mounted: Yes; Sense: No; Socket: No; SMD: Yes; Manufacturer1 ComponentHeight: 0.4mm; HelpURL: \\cern.ch\dfs\Applications\Altium\Datasheets\R0402_Phycomp_RC0402.pdf; Author: CERN DEM JLC; CreateDate: 03.12.2007; LatestRevisionDate: 17.10.2012
R152 = R0402_33K_1%_0.0625W_100PPM: Resistor - 1%; Part Description: General Purpose Thick Film Chip Resistor; Manufacturer: GENERIC; Manufacturer1 Part Number: 232270673303L; TC: ±100ppm/°C; PressFit: No; Part Number: R0402_33K_1%_0.0625W_100PPM; Component Kind: Standard; Component Type: Standard; Pin Count: 2; Value: 33k; Status: Not Recommended; Power: 0.0625W; Manufacturer Part Number: R0402_33K_1%_0.0625W_100PPM; Case: 0402; Mounted: Yes; Sense: No; Socket: No; SMD: Yes; Manufacturer1 ComponentHeight: 0.4mm; HelpURL: \\cern.ch\dfs\Applications\Altium\Datasheets\R0402_Phycomp_RC0402.pdf; Author: CERN DEM JLC; CreateDate: 12/3/2007; LatestRevisionDate: 10/17/2012; Manufacturer1 Example: YAGEO PHYCOMP
RN5 = RN_10K_5K_VISHAY_AORN2-1AT3: DIL8 Resistor Network 4 Resistors 10k-5k-5k-10k 0.1%; Part Description: Dual-In-Line Thin Film Precision Automotive Resistors Network, (4 Isolated) - AORN Series; Manufacturer1: VISHAY DALE; Manufacturer1 Part Number: AORN2-1AT5; Power: 4x0.1W; TC: ±25ppm/°C; PressFit: No; Part Number: RN_10K_5K_VISHAY_AORN2-1AT3; Component Kind: Standard; Component Type: Standard; Pin Count: 8; Value: 10k 5K 5K 10K; Sense: No; Tolerance: 0.1%; Case: SOIC8; Mounted: Yes; Socket: No; SMD: Yes; ComponentHeight: 1.73mm; HelpURL: \\cern.ch\dfs\Applications\Altium\Datasheets\RN_VISHAY_AORN.pdf; Author: CERN DEM JLC; CreateDate: 20.02.2017; LatestRevisionDate: 20.02.2017

## Nets that join several sheets
GND: MOD-COIL-LN2-21 (23 pins), SPI_IFC (14 pins), CPLD (45 pins), FPGA (16 pins), DAC_ADC (58 pins), U_Power_Stage (18 pins), U_Booster_con (24 pins), U_Diagnostics (13 pins), Power_Supply (69 pins), U_Power_Stage (18 pins), U_Booster_con (24 pins), U_Diagnostics (13 pins)
N6V0: DAC_ADC (6 pins), U_Power_Stage (C52A.2 C138A.2 IC8A.2 IC19A.4), U_Booster_con (C76A.2 C81A.2 IC23A.4 IC25A.4), U_Diagnostics (6 pins), Power_Supply (7 pins), U_Power_Stage (C52B.2 C138B.2 IC8B.2 IC19B.4), U_Booster_con (C76B.2 C81B.2 IC23B.4 IC25B.4), U_Diagnostics (6 pins)
P1V0_REF: U_Diagnostics (R114A.1 R115A.1 R116A.2), Power_Supply (IC31.1 IC31.4), U_Diagnostics (R114B.1 R115B.1 R116B.2)
P2V0_REF: U_Diagnostics (R105A.2), Power_Supply (IC33.6 IC33.7), U_Diagnostics (R105B.2)
P3V3: MOD-COIL-LN2-21 (18 pins), SPI_IFC (J1.B18), CPLD (35 pins), FPGA (22 pins), DAC_ADC (8 pins), U_Booster_con (9 pins), U_Diagnostics (C85A.2 IC30A.8 R109A.2), Power_Supply (C129.2 IC38.4 IC38.5 R147.2), U_Booster_con (9 pins), U_Diagnostics (C85B.2 IC30B.8 R109B.2)
P5V0_REF: DAC_ADC (11 pins), U_Diagnostics (IC32A.8 R124A.1), Power_Supply (C97.2 IC34.7 R129.2 RN5.4), U_Diagnostics (IC32B.8 R124B.1)
P5V4A: DAC_ADC (5 pins), U_Diagnostics (C91A.2 IC32A.7), Power_Supply (9 pins), U_Diagnostics (C91B.2 IC32B.7)
P6V0_REF: U_Power_Stage (R86A.1 RN2A.8 RN3A.1), Power_Supply (IC33.1 RN5.7), U_Power_Stage (R86B.1 RN2B.8 RN3B.1)
P12V0: MOD-COIL-LN2-21 (IC18.8 R56.2 R69.1), SPI_IFC (J1.A2 J1.A3)
P12V0_PS: U_Power_Stage (12 pins), Power_Supply (5 pins), U_Power_Stage (12 pins)
P12V0p: MOD-COIL-LN2-21 (R57.2 R69.2), U_Booster_con (C82A.2 IC26A.3 R98A.2), Power_Supply (11 pins), U_Booster_con (C82B.2 IC26B.3 R98B.2)
P15V0: DAC_ADC (C79.2 IC12.8 R3.2 R40.2), U_Power_Stage (C51A.2 C137A.2 IC8A.5 IC19A.8), U_Booster_con (C75A.2 C80A.2 IC23A.8 IC25A.7), U_Diagnostics (C83A.2 C89A.2 IC20A.8 IC29A.7), Power_Supply (8 pins), U_Power_Stage (C51B.2 C137B.2 IC8B.5 IC19B.8), U_Booster_con (C75B.2 C80B.2 IC23B.8 IC25B.7), U_Diagnostics (C83B.2 C89B.2 IC20B.8 IC29B.7)
ADC/DAC_MISO: FPGA (IC16.27), DAC_ADC (IC21.14 R43.2)
ADC/DAC_MOSI: FPGA (IC16.32), DAC_ADC (5 pins)
ADC/DAC_SCLK: FPGA (IC16.28), DAC_ADC (5 pins)
BOOSTER_EN: FPGA (IC16.11), U_Booster_con (IC22A.5)
BOOSTER_EN: FPGA (IC16.4), U_Booster_con (IC22B.5)
BOOSTER_KILL: FPGA (IC16.6), U_Booster_con (IC24B.5)
BOOSTER_KILL: FPGA (IC16.12), U_Booster_con (IC24A.5)
CH0_ADC_I_EXT: DAC_ADC (IC21.8), U_Booster_con (IC25A.5 IC25A.6)
CH0_ADC_I_INT: DAC_ADC (IC21.6), U_Diagnostics (IC20A.1 R120A.2 R121A.2)
CH0_ADC_V: DAC_ADC (IC21.17), U_Diagnostics (IC32A.5 IC32A.6)
CH0_BOOST_FLT: CPLD (IC2.63 IC15.14), U_Booster_con (J2A.13)
CH0_DIR_OK: FPGA (IC16.10), U_Booster_con (IC26A.1 IC26A.2 R99A.1)
CH0_ERR: MOD-COIL-LN2-21 (T1.1), CPLD (IC2.65 IC15.12), FPGA (IC16.23)
CH0_IMEAS_N: U_Power_Stage (R44A.E2 R75A.2), U_Diagnostics (R103A.1)
CH0_IMEAS_P: U_Power_Stage (R44A.E1 RN2A.7), U_Diagnostics (R110A.1)
CH0_OUT_N: MOD-COIL-LN2-21 (P1.2), U_Power_Stage (7 pins), U_Diagnostics (IC32A.2)
CH0_OUT_P: MOD-COIL-LN2-21 (P1.1), U_Power_Stage (R44A.I2), U_Diagnostics (IC32A.3)
CH0_ROLE_OK: FPGA (IC16.9), U_Booster_con (IC26A.13 IC26A.14 R94A.1)
CH0_V_LIM: MOD-COIL-LN2-21 (IC13.2 IC27.10 IC27.12), U_Diagnostics (IC30A.1 IC30A.7 R109A.1)
CH1_ADC_I_EXT: DAC_ADC (IC21.9), U_Booster_con (IC25B.5 IC25B.6)
CH1_ADC_I_INT: DAC_ADC (IC21.7), U_Diagnostics (IC20B.1 R120B.2 R121B.2)
CH1_ADC_V: DAC_ADC (IC21.16), U_Diagnostics (IC32B.5 IC32B.6)
CH1_BOOST_FLT: CPLD (IC2.64 IC15.13), U_Booster_con (J2B.13)
CH1_DIR_OK: FPGA (IC16.3), U_Booster_con (IC26B.1 IC26B.2 R99B.1)
CH1_ERR: MOD-COIL-LN2-21 (T2.1), CPLD (IC2.66 IC10.3 IC15.11 R76.1), FPGA (IC16.21)
CH1_IMEAS_N: U_Power_Stage (R44B.E2 R75B.2), U_Diagnostics (R103B.1)
CH1_IMEAS_P: U_Power_Stage (R44B.E1 RN2B.7), U_Diagnostics (R110B.1)
CH1_OUT_N: MOD-COIL-LN2-21 (P2.2), U_Power_Stage (7 pins), U_Diagnostics (IC32B.2)
CH1_OUT_P: MOD-COIL-LN2-21 (P2.1), U_Power_Stage (R44B.I2), U_Diagnostics (IC32B.3)
CH1_ROLE_OK: FPGA (IC16.2), U_Booster_con (IC26B.13 IC26B.14 R94B.1)
CH1_V_LIM: MOD-COIL-LN2-21 (IC14.2 IC27.2 IC27.4), U_Diagnostics (IC30B.1 IC30B.7 R109B.1)
CLK: MOD-COIL-LN2-21 (IC1.5), FPGA (IC16.37)
CLK10_N: MOD-COIL-LN2-21 (IC1.4), SPI_IFC (J1.A15)
CLK10_P: MOD-COIL-LN2-21 (IC1.3), SPI_IFC (J1.A14)
CLRn_0: FPGA (IC16.42), DAC_ADC (IC7.10 R26.1)
CLRn_1: FPGA (IC16.36), DAC_ADC (IC9.10 R34.1)
CSn_0: FPGA (IC16.25), DAC_ADC (C32.2 IC7.6)
CSn_1: FPGA (IC16.26), DAC_ADC (C57.2 IC9.6)
CSn_2: FPGA (IC16.31), DAC_ADC (IC21.11)
FAULTn: SPI_IFC (J1.B7), CPLD (IC2.19)
FPGA_CDONE: MOD-COIL-LN2-21 (R4.2), FPGA (IC16.7 J3.7)
FPGA_CRESET: MOD-COIL-LN2-21 (R5.2), FPGA (IC16.8 J3.9 R25.2)
FPGA_MISO: MOD-COIL-LN2-21 (R15.2), FPGA (IC16.14 J3.6 R19.1)
FPGA_MOSI: MOD-COIL-LN2-21 (R6.2), FPGA (IC16.17 J3.8 R20.1)
FPGA_SCK: MOD-COIL-LN2-21 (R7.2), FPGA (IC5.6 IC16.15 J3.4 R21.2)
FPGA_SS: MOD-COIL-LN2-21 (R13.2), FPGA (IC5.1 IC16.16 J3.10 R23.2)
GA0: SPI_IFC (J1.B1), CPLD (IC2.27 IC15.19 R8.2)
GA1: SPI_IFC (J1.B2), CPLD (IC2.21 IC10.6 IC15.20 R9.2)
GA2: SPI_IFC (J1.B3), CPLD (IC2.24 IC10.5 IC15.1 R10.2)
GA3: SPI_IFC (J1.B4), CPLD (IC2.25 IC15.10 R11.2)
HSPI_AD0: SPI_IFC (J1.B8), CPLD (IC2.18)
HSPI_AD1: SPI_IFC (J1.B9), CPLD (IC2.17)
HSPI_AD2: SPI_IFC (J1.B10), CPLD (IC2.16)
HSPI_AD3: SPI_IFC (J1.B11), CPLD (IC2.15)
HSPI_CLK: SPI_IFC (J1.A5), CPLD (IC2.12)
HSPI_CSn: SPI_IFC (J1.A8), CPLD (IC2.9)
HSPI_ID: SPI_IFC (J1.A6), CPLD (IC2.10)
HSPI_Q: SPI_IFC (J1.A9), CPLD (IC2.8)
HSPI_sAD0: SPI_IFC (J1.A12), CPLD (IC2.4)
HSPI_sAD1: SPI_IFC (J1.A11), CPLD (IC2.7)
INT/EXT_SEL_CH0: FPGA (IC16.46), DAC_ADC (IC3.6)
INT/EXT_SEL_CH1: FPGA (IC16.45), DAC_ADC (IC11.6)
LDACn_0: FPGA (IC16.43), DAC_ADC (C33.2 IC7.11)
LDACn_1: FPGA (IC16.38), DAC_ADC (C58.2 IC9.11)
LED0: MOD-COIL-LN2-21 (R49.1), CPLD (IC2.59)
LED1: MOD-COIL-LN2-21 (R51.1), CPLD (IC2.60)
Module_EN: SPI_IFC (J1.B14), CPLD (IC2.14 IC15.3)
NetIC2_30: MOD-COIL-LN2-21 (R22.1), CPLD (IC2.30)
NetIC2_67: MOD-COIL-LN2-21 (R48.1), CPLD (IC2.67)
NetIC2_68: MOD-COIL-LN2-21 (R47.1), CPLD (IC2.68)
NetIC3_8: DAC_ADC (IC3.8), U_Booster_con (R46A.1)
NetIC11_8: DAC_ADC (IC11.8), U_Booster_con (R46B.1)
NetJ1_B17: SPI_IFC (J1.B17), CPLD (5 pins)
Payload_EN: CPLD (IC2.29), Power_Supply (IC39.3 R127.2)
PPS: SPI_IFC (J1.B15), FPGA (IC16.44)
PWRMON_SPI_CSn: MOD-COIL-LN2-21 (IC18.1), CPLD (IC2.41)
PWRMON_SPI_Q: MOD-COIL-LN2-21 (IC18.4), CPLD (IC2.35)
REG_IN0: MOD-COIL-LN2-21 (R4.1), CPLD (IC2.42)
REG_IN1: MOD-COIL-LN2-21 (R5.1), CPLD (IC2.43)
REG_IN2: MOD-COIL-LN2-21 (R6.1), CPLD (IC2.45)
REG_IN3: MOD-COIL-LN2-21 (R7.1), CPLD (IC2.47)
REG_IN4: MOD-COIL-LN2-21 (R13.1), CPLD (IC2.48)
RESETn: SPI_IFC (J1.B12), CPLD (IC2.81), FPGA (IC16.18)
SCL: SPI_IFC (J1.B5), CPLD (IC2.13 IC10.2 IC15.16)
SDA: SPI_IFC (J1.B6), CPLD (IC2.20 IC10.1 IC15.17)
SPI_CLK: MOD-COIL-LN2-21 (IC18.5), CPLD (IC2.36)
SPI_MISO2: MOD-COIL-LN2-21 (R15.1), CPLD (IC2.34)
SPI_MOSI: MOD-COIL-LN2-21 (IC18.2), CPLD (IC2.37)
TCK: SPI_IFC (J1.B28), CPLD (IC2.91 J6.4 R1.1)
TDI: SPI_IFC (J1.A27), CPLD (IC2.94 J6.3 R80.1)
TDO: SPI_IFC (J1.B27), CPLD (IC2.95 J6.6)
TIME: SPI_IFC (J1.A18), FPGA (IC16.35)
TMS: SPI_IFC (J1.A28), CPLD (IC2.90 J6.2 R2.1)
TRIG: SPI_IFC (J1.A17), FPGA (IC16.34)
V_CTRL: DAC_ADC (IC3.2), U_Power_Stage (RN4A.5), U_Diagnostics (R112A.1)
V_CTRL: DAC_ADC (IC11.2), U_Power_Stage (RN4B.5), U_Diagnostics (R112B.1)
V_LIM_CH0: MOD-COIL-LN2-21 (IC13.4), FPGA (IC16.48)
V_LIM_CH1: MOD-COIL-LN2-21 (IC14.4), FPGA (IC16.47)